# Altium project breakout_breadboard.PrjPCB
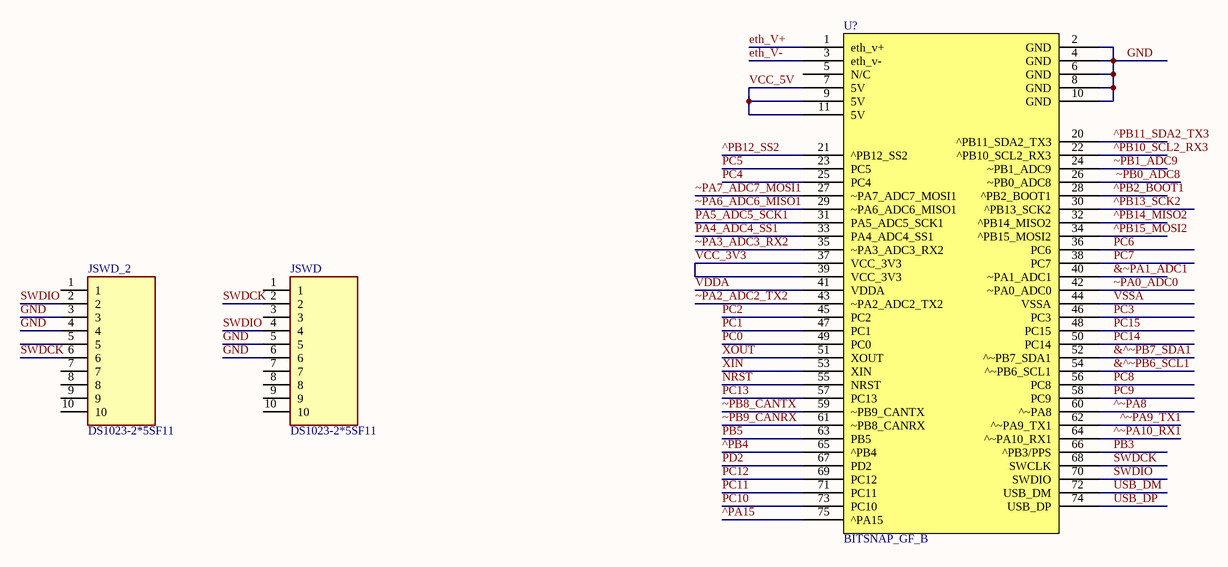
[diagram p0: breakout_breadboard.SchDoc]
1 sheet, 3 parts. Net scope: global (net labels, ports and power ports of the same name join across sheets).
Board file: breakout_breadboard.PcbDoc

## Sheet breakout_breadboard.SchDoc
size B

### Parts
JSWD  DS1023-2*5SF11  [HDR_FEM_2X5P]
JSWD_2  DS1023-2*5SF11  [HDR_FEM_2X5P]
U?  BITSNAP_GF_B  [POWERNET-MAC]

### Nets
&^~PB6_SCL1: U?.54(^~PB6_SCL1)
&^~PB7_SDA1: U?.52(^~PB7_SDA1)
&~PA1_ADC1: U?.40(~PA1_ADC1)
^PA15: U?.75(^PA15)
^PB2_BOOT1: U?.28(^PB2_BOOT1)
^PB4: U?.65(^PB4)
^PB10_SCL2_RX3: U?.22(^PB10_SCL2_RX3)
^PB11_SDA2_TX3: U?.20(^PB11_SDA2_TX3)
^PB12_SS2: U?.21(^PB12_SS2)
^PB13_SCK2: U?.30(^PB13_SCK2)
^PB14_MISO2: U?.32(^PB14_MISO2)
^PB15_MOSI2: U?.34(^PB15_MOSI2)
^~PA8: U?.60(^~PA8)
^~PA9_TX1: U?.62(^~PA9_TX1)
^~PA10_RX1: U?.64(^~PA10_RX1)
eth_V+: U?.1(eth_v+)
eth_V-: U?.3(eth_v-)
GND: JSWD.5 JSWD.6 JSWD_2.3 JSWD_2.4 U?.2(GND) U?.4(GND) U?.6(GND) U?.8(GND) U?.10(GND)
NRST: U?.55(NRST)
PA4_ADC4_SS1: U?.33(PA4_ADC4_SS1)
PA5_ADC5_SCK1: U?.31(PA5_ADC5_SCK1)
PB3: U?.66(^PB3/PPS)
PB5: U?.63(PB5)
PC0: U?.49(PC0)
PC1: U?.47(PC1)
PC2: U?.45(PC2)
PC3: U?.46(PC3)
PC4: U?.25(PC4)
PC5: U?.23(PC5)
PC6: U?.36(PC6)
PC7: U?.38(PC7)
PC8: U?.56(PC8)
PC9: U?.58(PC9)
PC10: U?.73(PC10)
PC11: U?.71(PC11)
PC12: U?.69(PC12)
PC13: U?.57(PC13)
PC14: U?.50(PC14)
PC15: U?.48(PC15)
PD2: U?.67(PD2)
SWDCK: JSWD.2 JSWD_2.6 U?.68(SWCLK)
SWDIO: JSWD.4 JSWD_2.2 U?.70(SWDIO)
USB_DM: U?.72(USB_DM)
USB_DP: U?.74(USB_DP)
VCC_3V3: U?.37(VCC_3V3) U?.39(VCC_3V3)
VCC_5V: U?.7(5V) U?.9(5V) U?.11(5V)
VDDA: U?.41(VDDA)
VSSA: U?.44(VSSA)
XIN: U?.53(XIN)
XOUT: U?.51(XOUT)
~PA0_ADC0: U?.42(~PA0_ADC0)
~PA2_ADC2_TX2: U?.43(~PA2_ADC2_TX2)
~PA3_ADC3_RX2: U?.35(~PA3_ADC3_RX2)
~PA6_ADC6_MISO1: U?.29(~PA6_ADC6_MISO1)
~PA7_ADC7_MOSI1: U?.27(~PA7_ADC7_MOSI1)
~PB0_ADC8: U?.26(~PB0_ADC8)
~PB1_ADC9: U?.24(~PB1_ADC9)
~PB8_CANTX: U?.59(~PB9_CANTX)
~PB9_CANRX: U?.61(~PB8_CANRX)

Not connected (* = marked no-connect by the designer): JSWD 1 3 7 8 9 10; JSWD_2 1 5 7 8 9 10; U? 5(N/C)

### Library data of the parts
JSWD JSWD_2 = DS1023-2*5SF11: J - JACK - PIN_HEADER 2X5P; LCSC Part #: C92270; JLC Availability: Extended
U? = POWERNET_MAC: U - IC - Bitsnap CPU, NGFF B Key; Manufacturer: Foxconn; Manufacturer P/N: AS0BC21-S30BB-7H; LCSC Part #: C2761344